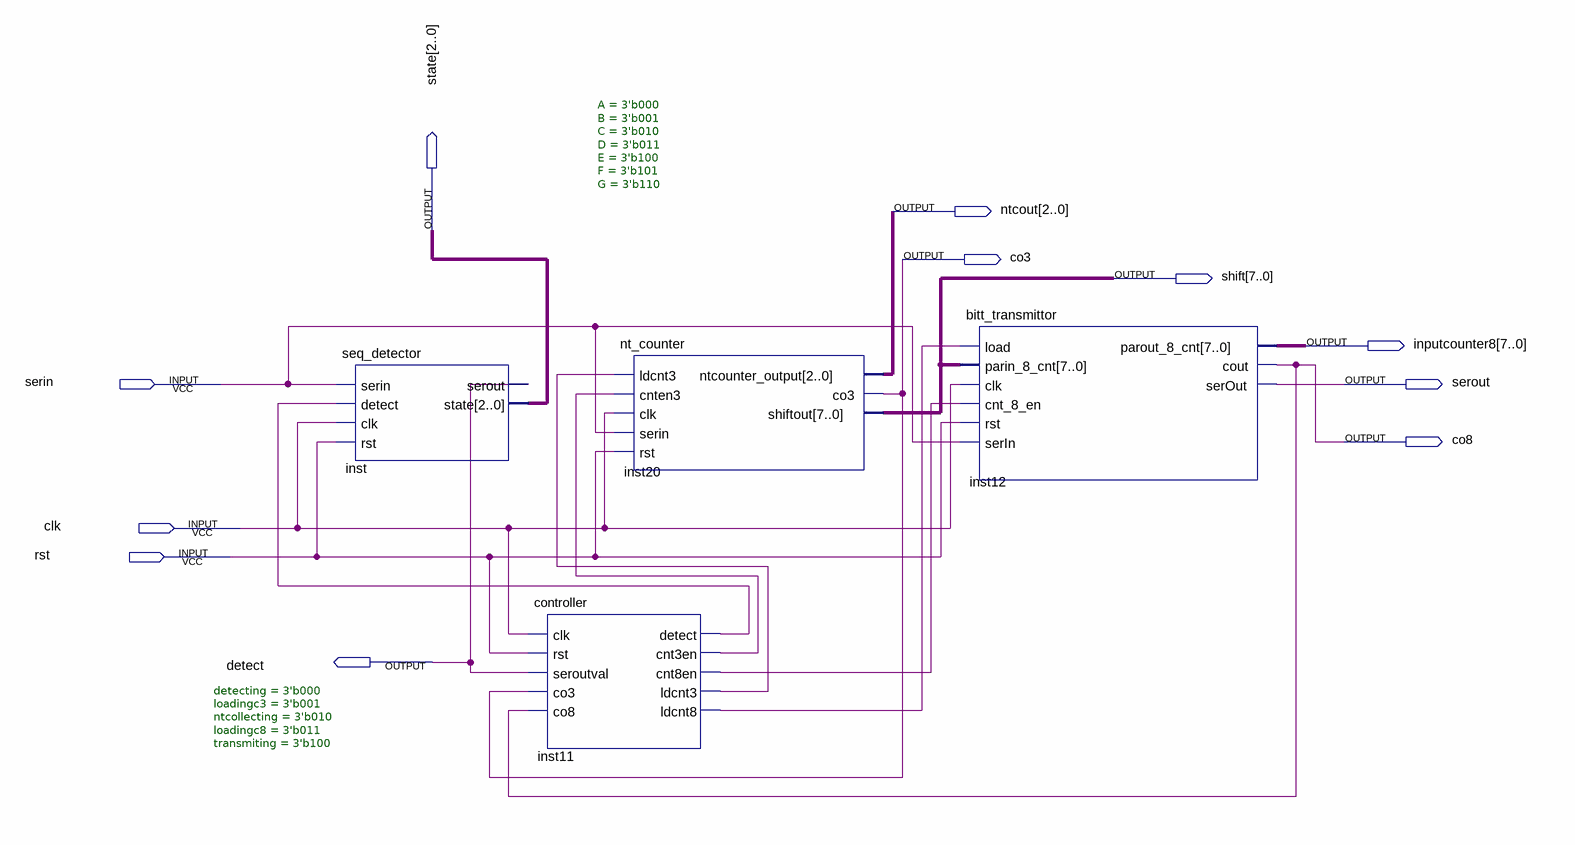
[diagram p0: schematic sheet]
// Quartus schematic finalsyst.bdf as structural Verilog: 4 symbols, 11 pins
module finalsyst (
  input  serin,
  input  clk,
  input  rst,
  output [2:0] ntcout,
  output [2:0] state,
  output co3,
  output [7:0] shift,
  output [7:0] inputcounter8,
  output serout,
  output co8,
  output detect
);

  wire inst11_cnt3en, inst11_cnt8en, inst11_detect, inst11_ldcnt3, inst11_ldcnt8;

  seq_detector #(.A(3'b000), .B(3'b001), .C(3'b010), .D(3'b011), .E(3'b100), .F(3'b101), .G(3'b110)) inst (
    .serin(serin), .detect(inst11_detect), .clk(clk), .rst(rst), .serout(detect), .state(state));
  controller #(.detecting(3'b000), .loadingc3(3'b001), .ntcollecting(3'b010), .loadingc8(3'b011), .transmiting(3'b100)) inst11 (
    .clk(clk), .rst(rst), .seroutval(detect), .co3(co3), .co8(co8), .detect(inst11_detect),
    .cnt3en(inst11_cnt3en), .cnt8en(inst11_cnt8en), .ldcnt3(inst11_ldcnt3), .ldcnt8(inst11_ldcnt8));
  nt_counter inst20 (
    .ldcnt3(inst11_ldcnt3), .cnten3(inst11_cnt3en), .clk(clk), .serin(serin), .rst(rst),
    .ntcounter_output(ntcout), .co3(co3), .shiftout(shift));
  bitt_transmittor inst12 (
    .load(inst11_ldcnt8), .parin_8_cnt(shift), .clk(clk), .cnt_8_en(inst11_cnt8en), .rst(rst), .serIn(serin),
    .parout_8_cnt(inputcounter8), .cout(co8), .serOut(serout));
endmodule
